# Altium schematic sheet spdif_audio.SchDoc
size A
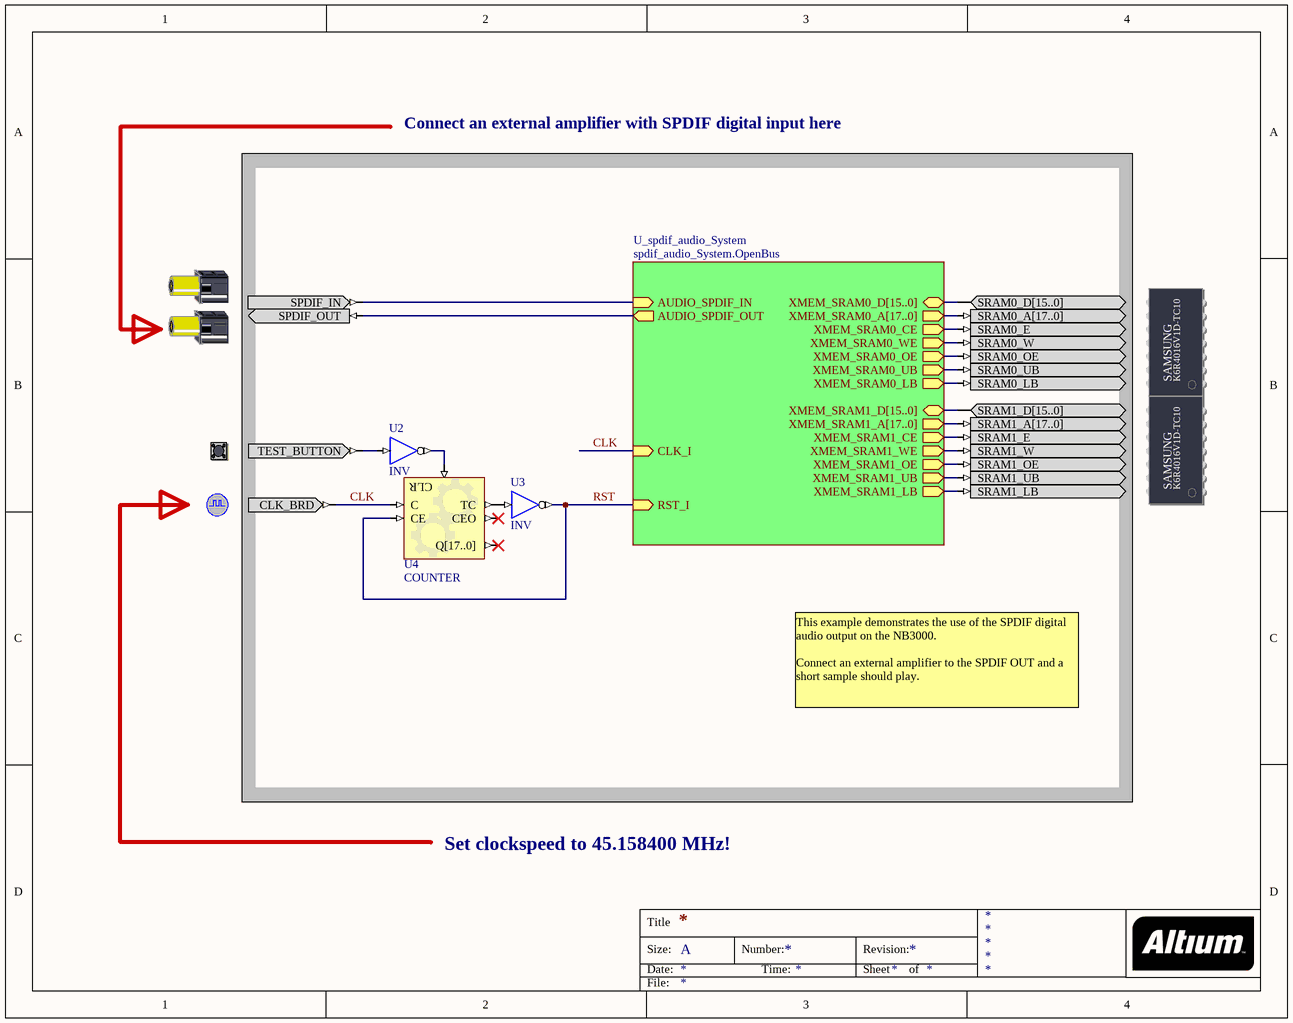
[diagram p0: spdif_audio.SchDoc]

## Parts
(Parts that share a designator on the sheet are numbered #1, #2 ... from top to bottom, then left to right.)
?#1  SRAM0  (value not drawn)
?#2  SPDIF  (value not drawn)
?#3  SRAM1  (value not drawn)
?#4  TEST_BUTTON  (value not drawn)
?#5  CLOCK_BOARD  (value not drawn)
U2  INV
U3  INV
U4  COUNTER

## Sub-sheets
U_spdif_audio_System = spdif_audio_System.OpenBus: XMEM_SRAM0_D[15..0] (bidir), XMEM_SRAM0_A[17..0] (out), XMEM_SRAM0_CE (out), XMEM_SRAM0_WE (out), XMEM_SRAM0_OE (out), XMEM_SRAM0_UB (out), XMEM_SRAM0_LB (out), XMEM_SRAM1_D[15..0] (bidir), XMEM_SRAM1_A[17..0] (out), XMEM_SRAM1_CE (out), XMEM_SRAM1_WE (out), XMEM_SRAM1_OE (out), XMEM_SRAM1_UB (out), XMEM_SRAM1_LB (out), RST_I (in), CLK_I (in), AUDIO_SPDIF_IN (in), AUDIO_SPDIF_OUT (out)

## Nets
CLK: ?#5.CLK_BRD U4.C ; sheet U_spdif_audio_System/CLK_I
RST: U3.O U4.CE ; sheet U_spdif_audio_System/RST_I
Net?#1_SRAM0_A[17..0]: ?#1.SRAM0_A[17..0] ; sheet U_spdif_audio_System/XMEM_SRAM0_A[17..0]
Net?#1_SRAM0_D[15..0]: ?#1.SRAM0_D[15..0] ; sheet U_spdif_audio_System/XMEM_SRAM0_D[15..0]
Net?#1_SRAM0_E: ?#1.SRAM0_E ; sheet U_spdif_audio_System/XMEM_SRAM0_CE
Net?#1_SRAM0_LB: ?#1.SRAM0_LB ; sheet U_spdif_audio_System/XMEM_SRAM0_LB
Net?#1_SRAM0_OE: ?#1.SRAM0_OE ; sheet U_spdif_audio_System/XMEM_SRAM0_OE
Net?#1_SRAM0_UB: ?#1.SRAM0_UB ; sheet U_spdif_audio_System/XMEM_SRAM0_UB
Net?#1_SRAM0_W: ?#1.SRAM0_W ; sheet U_spdif_audio_System/XMEM_SRAM0_WE
Net?#2_SPDIF_IN: ?#2.SPDIF_IN ; sheet U_spdif_audio_System/AUDIO_SPDIF_IN
Net?#2_SPDIF_OUT: ?#2.SPDIF_OUT ; sheet U_spdif_audio_System/AUDIO_SPDIF_OUT
Net?#3_SRAM1_A[17..0]: ?#3.SRAM1_A[17..0] ; sheet U_spdif_audio_System/XMEM_SRAM1_A[17..0]
Net?#3_SRAM1_D[15..0]: ?#3.SRAM1_D[15..0] ; sheet U_spdif_audio_System/XMEM_SRAM1_D[15..0]
Net?#3_SRAM1_E: ?#3.SRAM1_E ; sheet U_spdif_audio_System/XMEM_SRAM1_CE
Net?#3_SRAM1_LB: ?#3.SRAM1_LB ; sheet U_spdif_audio_System/XMEM_SRAM1_LB
Net?#3_SRAM1_OE: ?#3.SRAM1_OE ; sheet U_spdif_audio_System/XMEM_SRAM1_OE
Net?#3_SRAM1_UB: ?#3.SRAM1_UB ; sheet U_spdif_audio_System/XMEM_SRAM1_UB
Net?#3_SRAM1_W: ?#3.SRAM1_W ; sheet U_spdif_audio_System/XMEM_SRAM1_WE
Net?#4_TEST_BUTTON: ?#4.TEST_BUTTON U2.I
NetU2_O: U2.O U4.CLR
NetU3_I: U3.I U4.TC

Not connected (* = marked no-connect by the designer): U4 CEO* Q[17..0]*

## Notes on the sheet
- Connect an external amplifier with SPDIF digital input here
- This example demonstrates the use of the SPDIF digital audio output on the NB3000.
  Connect an external amplifier to the SPDIF OUT and a short sample should play.
- Set clockspeed to 45.158400 MHz!
- Title
- Size:
- Date:
- A
- Number:
- Time:
- Revision:
- Sheet
- of
- File:
- (in symbol SRAM0) SAMSUNG; K6R4016V1D-TC10
- (in symbol SRAM1) SAMSUNG; K6R4016V1D-TC10

## Library data of the parts
?#1 = SRAM0: Free Static RAM - Daughterboard; PortComponent: True; Published: 14-May-2007; Publisher: Altium Limited; HelpURL: TR0149 Technical Reference for Altium's Xilinx Spartan-3 Daughter Board DB30.pdf#page=16
?#2 = SPDIF: Sony Philips Digital InterFace; PortComponent: True; Published: 11-Mar-2008; Publisher: Altium Limited
?#3 = SRAM1: Free Static RAM - Daughterboard; PortComponent: True; Published: 14-May-2007; Publisher: Altium Limited; HelpURL: TR0149 Technical Reference for Altium's Xilinx Spartan-3 Daughter Board DB30.pdf#page=16
?#4 = TEST_BUTTON: Test / Reset Button; PortComponent: True; Published: 19-Nov-2003; Publisher: Altium Limited; HelpURL: TR0143 Technical Reference Manual for Altium's Desktop NanoBoard NB2DSK01.pdf#page=53
?#5 = CLOCK_BOARD: Global System Clock Supply; PortComponent: True; Published: 19-Nov-2003; Publisher: Altium Limited; HelpURL: TR0143 Technical Reference Manual for Altium's Desktop NanoBoard NB2DSK01.pdf#page=41; UseInDSF: True
U2 U3 = INV: Inverter; FunctionalClass: Logic Primitive; ArchiveName: GENERIC; VHDLIB_SIM: GENERIC_LIB; Published: 29-Jan-2004; Publisher: Altium Limited; XilinxEquivalent: INV; LastRevisionNo: 1.00.00; HelpURL: CR0118 FPGA Generic Library Guide.pdf#page=291; ComponentLink1URL: CR0136 FPGA Logic Primitive Resource Usage.pdf#page=61; ComponentLink1Description: Core &Resource Usage; SubClass: INV
U4 = COUNTER: Configurable Counter; ConfiguratorName: GENERIC_COUNTER; ConfigurationParameters: {}Version[1.0]{}Type[Binary]{}SyncReset[False]{}NegativeClockEdge[False]{}FixedDirection[True]{}IsIncrement[True]{}SignalWidth[18]{}MaxValue[262143]{}BusOutput[True]{}Loadable[False]{}BusInput[False]{}; LastRevisionNo: 1.00.00; Published: 14-Jan-2009; Publisher: Altium Limited